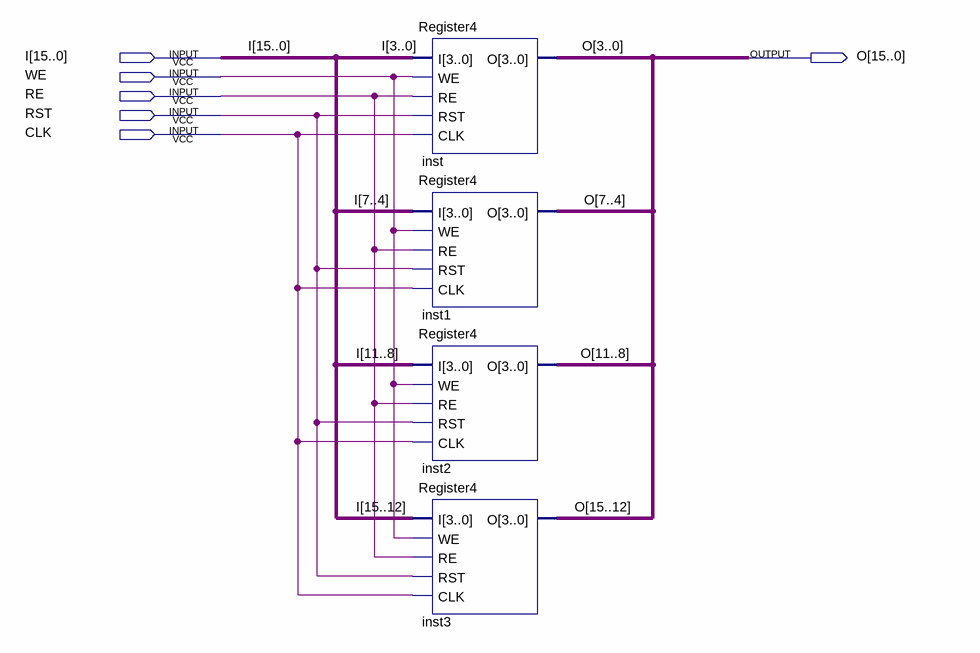
[diagram p0: schematic sheet]
// Quartus schematic Register16.bdf as structural Verilog: 4 symbols, 6 pins
module Register16 (
  input  [15:0] I,
  input  WE,
  input  RE,
  input  RST,
  input  CLK,
  output [15:0] O
);

  Register4 inst (.I(I[3:0]), .WE(WE), .RE(RE), .RST(RST), .CLK(CLK), .O(O[3:0]));
  Register4 inst1 (.I(I[7:4]), .WE(WE), .RE(RE), .RST(RST), .CLK(CLK), .O(O[7:4]));
  Register4 inst2 (.I(I[11:8]), .WE(WE), .RE(RE), .RST(RST), .CLK(CLK), .O(O[11:8]));
  Register4 inst3 (.I(I[15:12]), .WE(WE), .RE(RE), .RST(RST), .CLK(CLK), .O(O[15:12]));
endmodule
